# EAGLE design DIO (EAGLE 7.1.0)
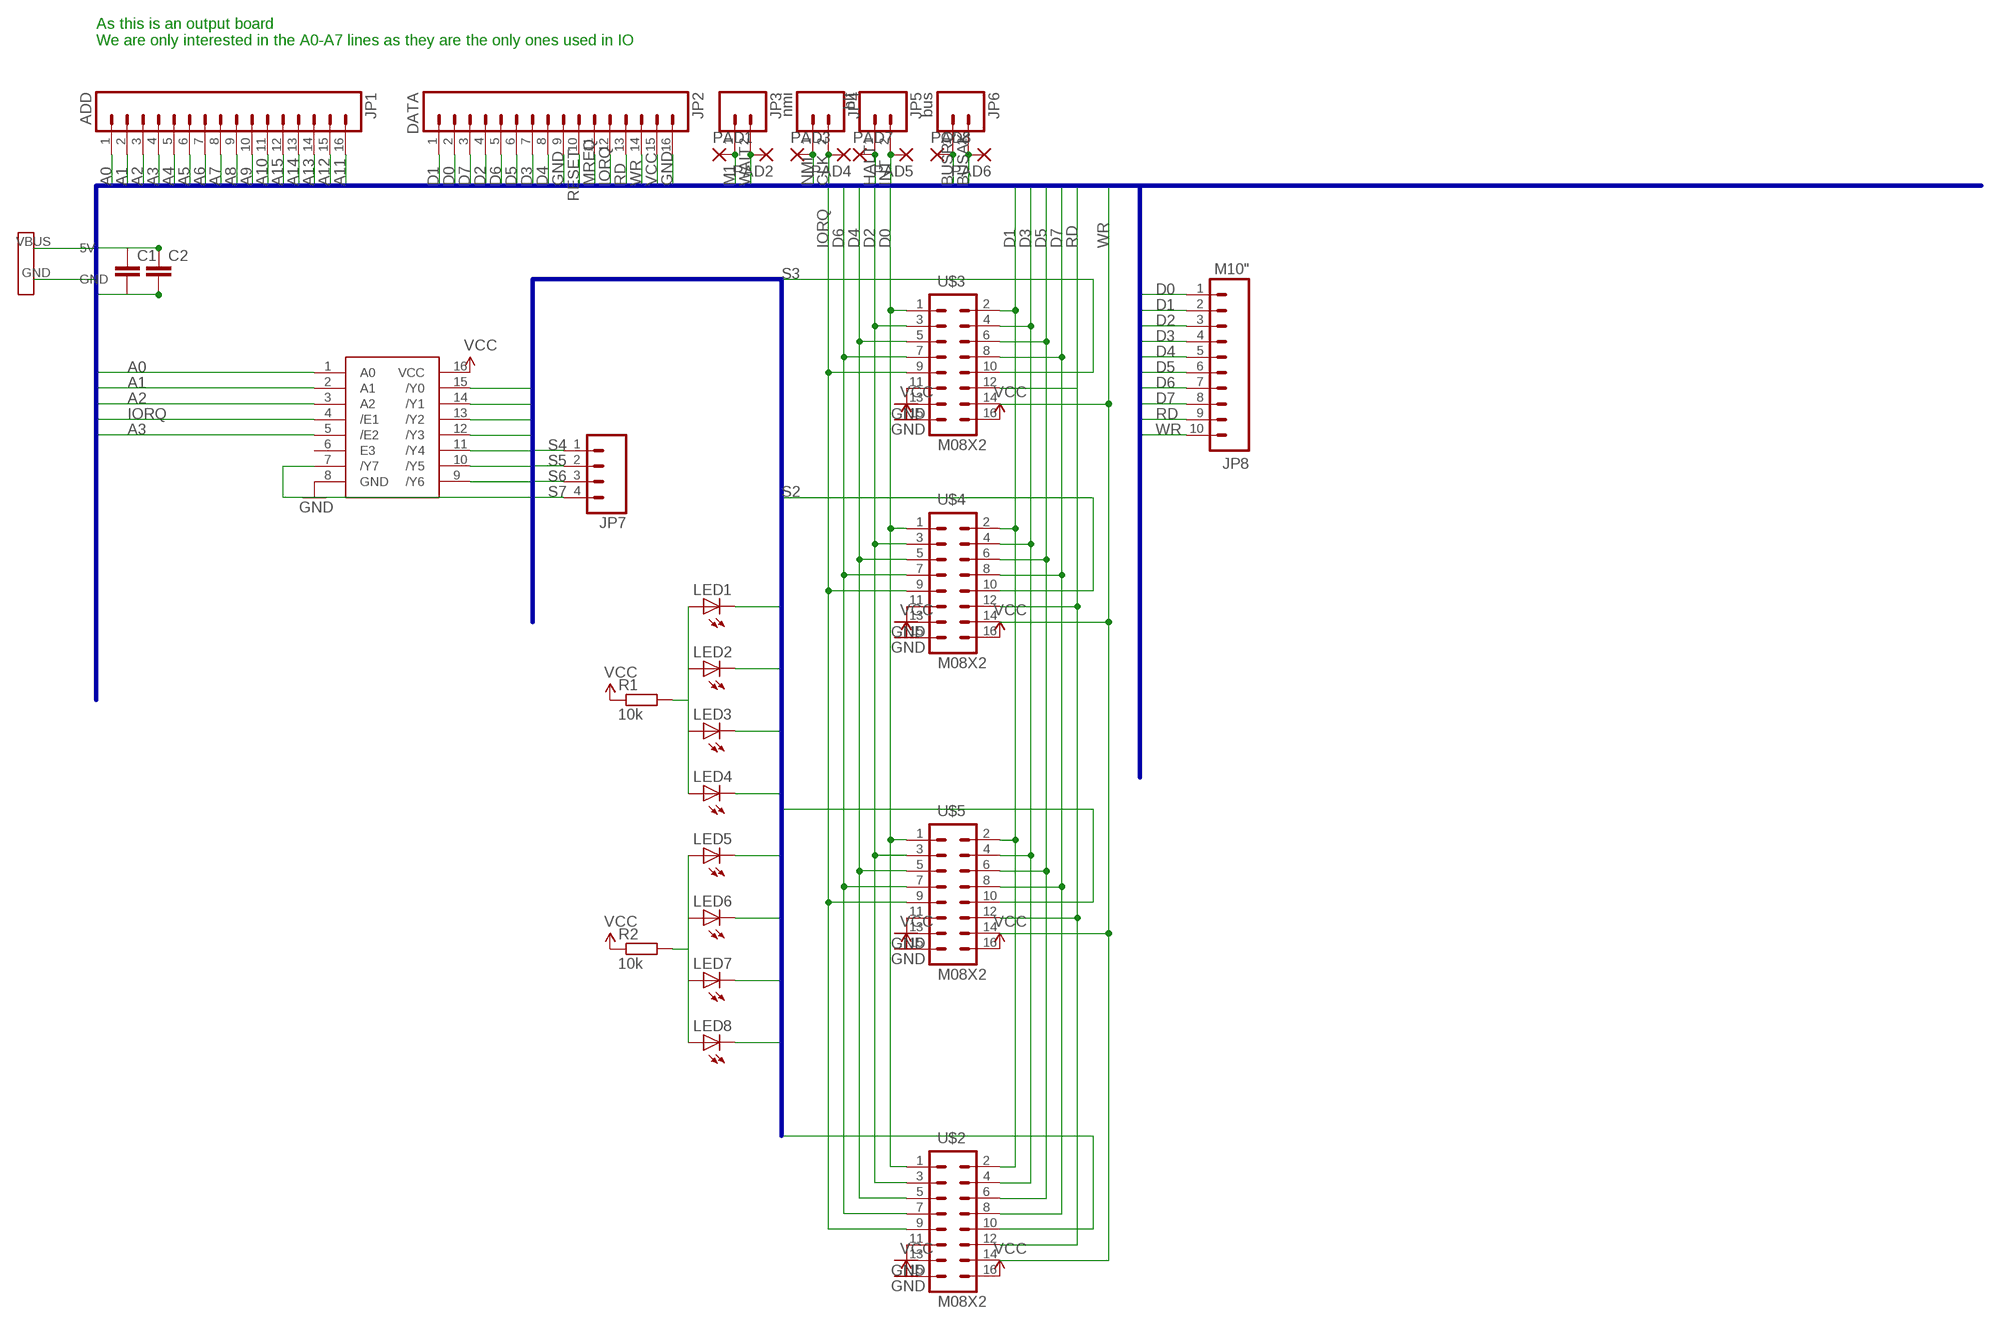
[diagram p0: schematic, sheet 1]

## Parts
C1  C-EUC0805  [C0805]
C2  C-EUC0805  [C0805]
JP1  ADD  M16PTH  [1X16]
JP2  DATA  M16PTH  [1X16]
JP3  M02PTH  [1X02]
JP4  nmi  M02PTH  [1X02]
JP5  hlt  M02PTH  [1X02]
JP6  bus  M02PTH  [1X02]
JP7  M04PTH  [1X04]
JP8  M10"  [1X10]
LED1  LEDCHIP-LED0805  [CHIP-LED0805]
LED2  LEDCHIP-LED0805  [CHIP-LED0805]
LED3  LEDCHIP-LED0805  [CHIP-LED0805]
LED4  LEDCHIP-LED0805  [CHIP-LED0805]
LED5  LEDCHIP-LED0805  [CHIP-LED0805]
LED6  LEDCHIP-LED0805  [CHIP-LED0805]
LED7  LEDCHIP-LED0805  [CHIP-LED0805]
LED8  LEDCHIP-LED0805  [CHIP-LED0805]
PAD1  SMD2  [SMD1,27-2,54]
PAD2  SMD2  [SMD1,27-2,54]
PAD3  SMD2  [SMD1,27-2,54]
PAD4  SMD2  [SMD1,27-2,54]
PAD5  SMD2  [SMD1,27-2,54]
PAD6  SMD2  [SMD1,27-2,54]
PAD7  SMD2  [SMD1,27-2,54]
PAD8  SMD2  [SMD1,27-2,54]
R1  10k  R-EU_M0805  [M0805]
R2  10k  R-EU_M0805  [M0805]
U$1  74LVC138AD  [SO016]
U$2  M08X2  [2X8]
U$3  M08X2  [2X8]
U$4  M08X2  [2X8]
U$5  M08X2  [2X8]
U$6  USB-MICRO-PWR  [USB-MICROB-PWR]

## Nets
A0: JP1.1 U$1.1(A0)
A1: JP1.2 U$1.2(A1)
A2: JP1.3 U$1.3(A2)
A3: JP1.4 U$1.5(/E2)
A4: JP1.5
A5: JP1.6
A6: JP1.7
A7: JP1.8
A8: JP1.9
A9: JP1.10
A10: JP1.11
A11: JP1.16
A12: JP1.15
A13: JP1.14
A14: JP1.13
A15: JP1.12
BUSAK: JP6.2 PAD6.1(P)
BUSRQ: JP6.1 PAD8.1(P)
CLK: JP4.2 PAD4.1(P)
D0: JP2.2 JP8.1 U$2.1 U$3.1 U$4.1 U$5.1
D1: JP2.1 JP8.2 U$2.2 U$3.2 U$4.2 U$5.2
D2: JP2.4 JP8.3 U$2.3 U$3.3 U$4.3 U$5.3
D3: JP2.7 JP8.4 U$2.4 U$3.4 U$4.4 U$5.4
D4: JP2.8 JP8.5 U$2.5 U$3.5 U$4.5 U$5.5
D5: JP2.6 JP8.6 U$2.6 U$3.6 U$4.6 U$5.6
D6: JP2.5 JP8.7 U$2.7 U$3.7 U$4.7 U$5.7
D7: JP2.3 JP8.8 U$2.8 U$3.8 U$4.8 U$5.8
GND: C1.2 C2.2 JP2.9 JP2.16 U$1.8(GND) U$2.11 U$2.13 U$3.11 U$3.13 U$4.11 U$4.13 U$5.11 U$5.13 U$6.GND
HALT: JP5.1 PAD7.1(P)
INT: JP5.2 PAD5.1(P)
IORQ: JP2.12 U$1.4(/E1) U$2.9 U$3.9 U$4.9 U$5.9
M1: JP3.1 PAD1.1(P)
MREQ: JP2.11
N$1: LED1.A LED2.A LED3.A LED4.A R1.2
N$2: LED5.A LED6.A LED7.A LED8.A R2.2
NMI: JP4.1 PAD3.1(P)
RD: JP2.13 JP8.9 U$2.12 U$3.12 U$4.12 U$5.12
RESET: JP2.10
S0: LED1.C U$1.15(/Y0) U$2.10
S1: LED2.C U$1.14(/Y1) U$5.10
S2: LED3.C U$1.13(/Y2) U$4.10
S3: LED4.C U$1.12(/Y3) U$3.10
S4: JP7.1 LED5.C U$1.11(/Y4)
S5: JP7.2 LED6.C U$1.10(/Y5)
S6: JP7.3 LED7.C U$1.9(/Y6)
S7: JP7.4 LED8.C U$1.7(/Y7)
VCC: C1.1 C2.1 JP2.15 R1.1 R2.1 U$1.16(VCC) U$2.15 U$2.16 U$3.15 U$3.16 U$4.15 U$4.16 U$5.15 U$5.16 U$6.VBUS(5V)
WAIT: JP3.2 PAD2.1(P)
WR: JP2.14 JP8.10 U$2.14 U$3.14 U$4.14 U$5.14
Unconnected: U$1.6(E3)

## Buses
A0,A1,A2,A3,A4,A5,A6,A7,A8,A9,A10,A11,A12,A13,A14,A15,D0,D1,D2,D3,D4,D5,D6,D7,GND,VCC,WR,RD,IORQ,MREQ,RESET,M1,CLK,WAIT,NMI,HALT,INT,BUSRQ,BUSAK
S0,S1,S2,S3,S4,S5,S6,S7

## Notes on the sheet
- As this is an output board
  We are only interested in the A0-A7 lines as they are the only ones used in IO

## Library data of the parts
C1 C2 = rcl:C-EU: CAPACITOR, European symbol
JP1 JP2 = SparkFun-Connectors:M16: 1x16 .1" header
JP3-JP6 = SparkFun:M02: Header 2 Standard 2-pin 0.1" header. Use with straight break away headers (SKU : PRT-00116), right angle break away headers (PRT-00553), swiss pins (PRT-00743), machine pins (PRT-00117), and female headers (PRT-00115). Molex polarized connector foot print use with SKU : PRT-08233 with associated crimp pins and housings.
JP7 = SparkFun-Connectors:M04: Header 4 Standard 4-pin 0.1" header. Use with straight break away headers (SKU : PRT-00116), right angle break away headers (PRT-00553), swiss pins (PRT-00743), machine pins (PRT-00117), and female headers (PRT-00115). Molex polarized connector foot print use with SKU : PRT-08231 with associated crimp pins and housings. 1MM SMD Version SKU: PRT-10208
JP8 = SparkFun:M10: Header 10 Standard 10-pin 0.1" header. Use with straight break away headers (SKU : PRT-00116), right angle break away headers (PRT-00553), swiss pins (PRT-00743), machine pins (PRT-00117), and female headers (PRT-00115).
LED1-LED8 = adafruit:LED: LED OSRAM: - CHIPLED LG R971, LG N971, LY N971, LG Q971, LY Q971, LO R971, LY R971 LH N974, LH R974 LS Q976, LO Q976, LY Q976 LO Q996 - Hyper CHIPLED LW Q18S LB Q993, LB Q99A, LB R99A - SideLED LS A670, LO A670, LY A670, LG A670, LP A670 LB A673, LV A673, LT A673, LW A673 LH A674 LY A675 LS A676, LA A676, LO A676, LY A676, LW A676 LS A679, LY A679, LG A679 - Hyper Micro SIDELED® LS Y876, LA Y876, LO Y876, LY Y876 LT Y87S - SmartLED LW L88C, LW L88S LB L89C, LB L89S, LG L890 LS L89K, LO L89K, LY L89K LS L896, LA L896, LO L896, LY L896 - TOPLED LS T670, LO T670, LY T670, LG T670, LP T670 LSG T670, LSP T670, LSY T670, LOP T670, LYG T670 LG T671, LOG T671, LSG T671 LB T673, LV T673, LT T673, LW T673 LH T674 LS T676, LA T676, LO T676, LY T676, LB T676, LH T676, LSB T676, LW T676 LB T67C, LV T67C, LT T67C, LS T67K, LO T67K, LY T67K, LW E67C LS E67B, LA E67B, LO E67B, LY E67B, LB E67C, LV E67C, LT E67C LW T67C LS T679, LY T679, LG T679 LS T770, LO T770, LY T770, LG T770, LP T770 LB T773, LV T773, LT T773, LW T773 LH T774 LS E675, LA E675, LY E675, LS T675 LS T776, LA T776, LO T776, LY T776, LB T776 LHGB T686 LT T68C, LB T68C - Hyper Mini TOPLED® LB M676 - Mini TOPLED Santana® LG M470 LS M47K, LO M47K, LY M47K Source: http://www.osram.convergy.de/
PAD1-PAD8 = wirepad:SMD2: SMD PAD
R1 R2 = rcl:R-EU_: RESISTOR, European symbol
U$1 = SparkFun-DigitalIC:74LVC138AD: 3-to-8 decoder
U$2-U$5 = SparkFun-Connectors:M08X2: .1" headers, two rows of 8 each
U$6 = RalimTek:USB-MICRO-PWR

## Board
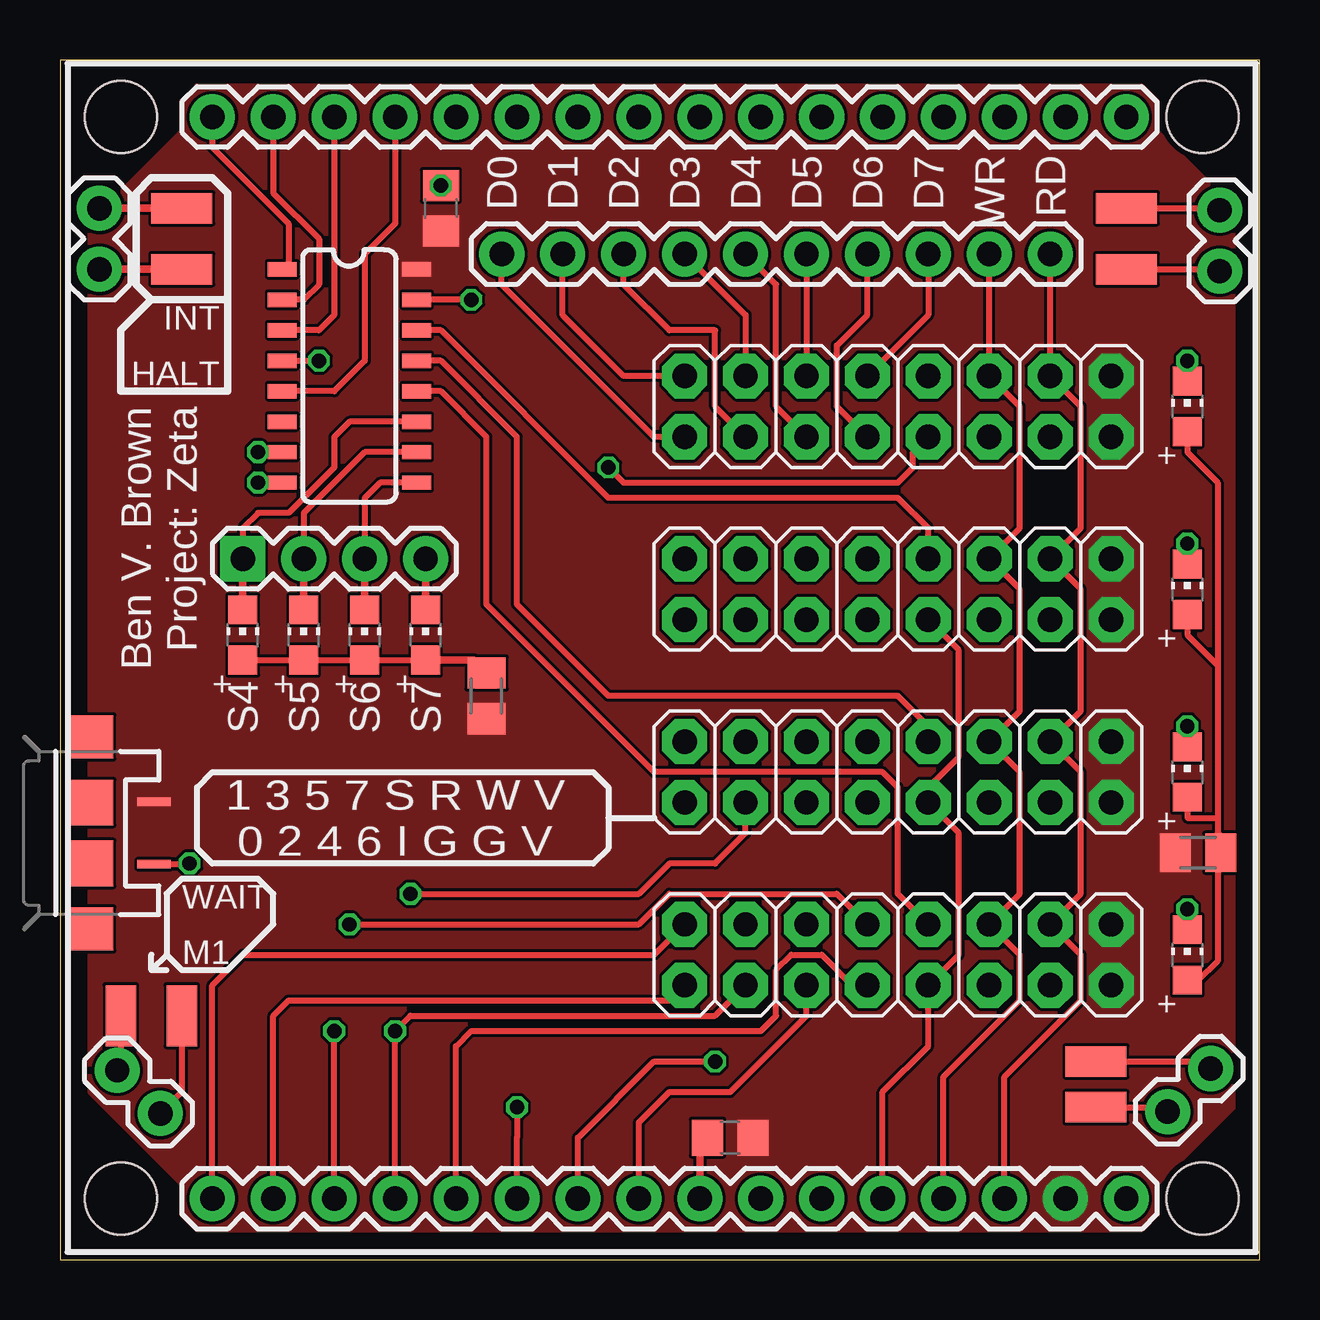
[diagram p1: board, top side]
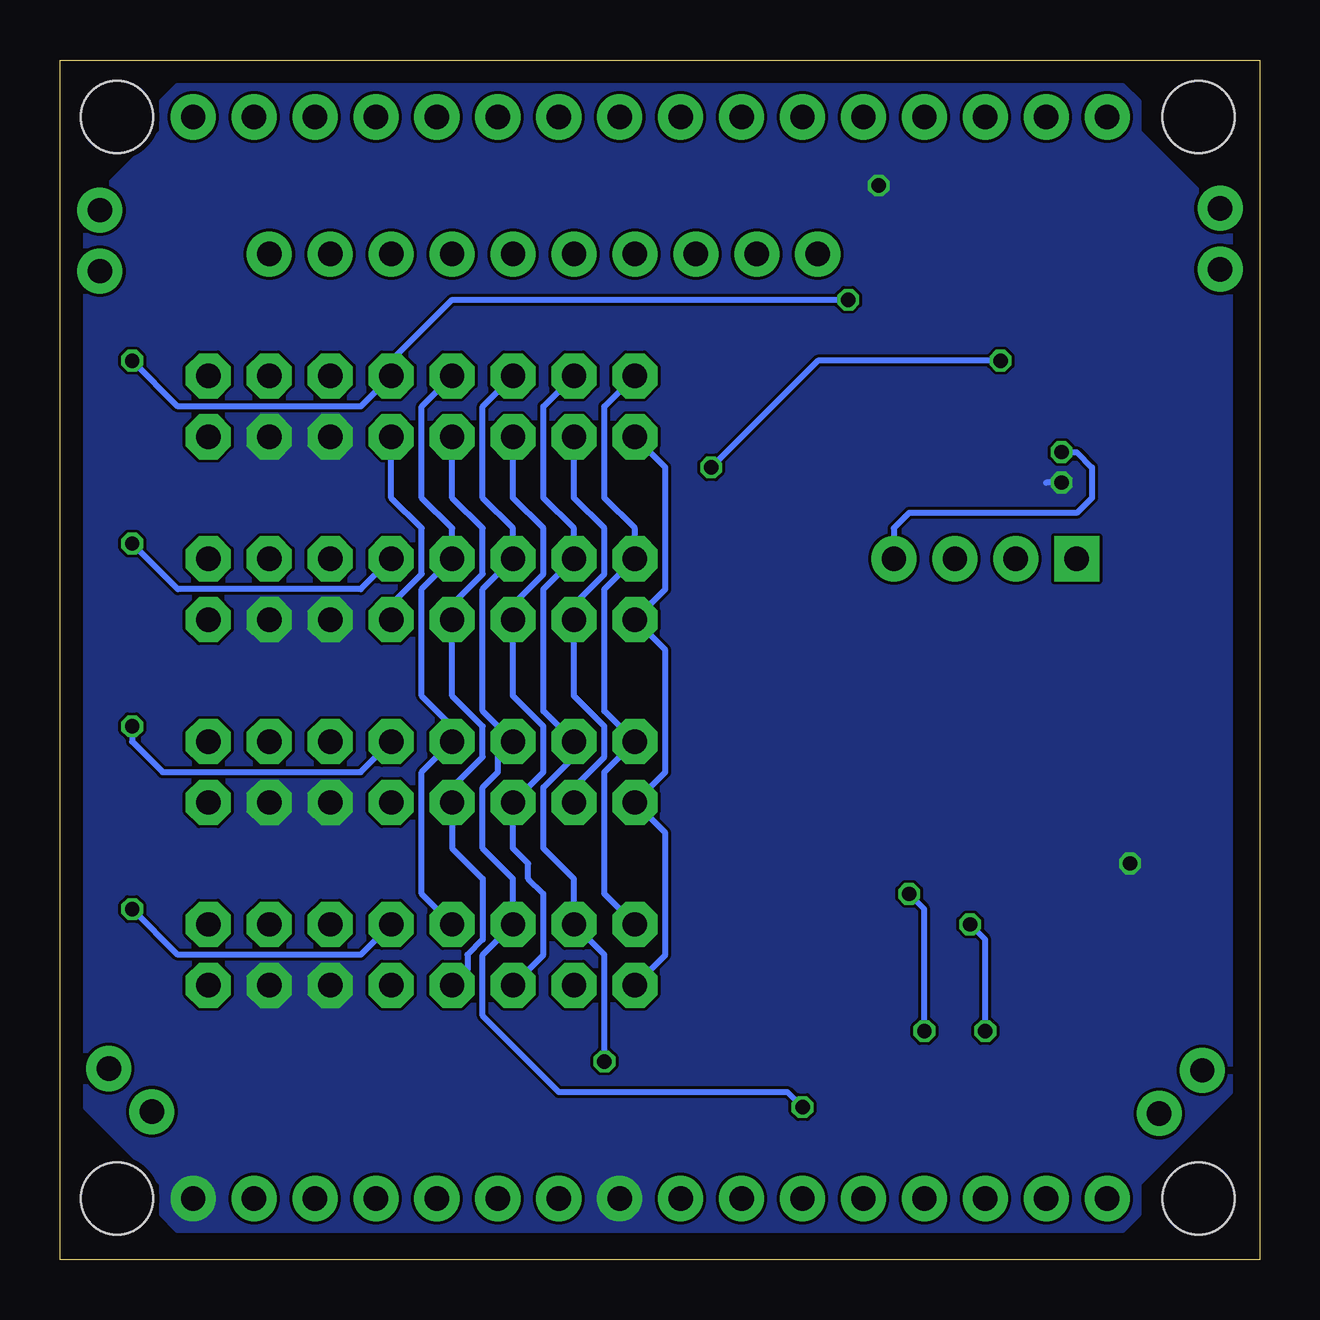
[diagram p2: board, bottom side, seen from below]

Size 50 x 50 mm. Coordinates in mm from the lower left corner, seen from the top.
Outline: 0,0 50,0 50,50 0,50 0,0
Copper layers (1*16): Top 0.035mm / dielectric 1.5mm / Bottom 0.035mm
Design rules "dirt_cheap_dirty_boards.v1": minimum track width 5mil, minimum drill 12mil, track to track 5mil, track to pad 5mil, pad to pad 5mil, via to via 5mil, smd to smd 0mil, copper to edge 10mil, drill to drill 10mil, minimum pad ring 10mil, minimum via ring 6mil, stop-mask expansion 2mil, vias tented up to drill 25mil, thermal gap 10mil
Holes 3 mm at 2.54,47.62 47.62,47.62 47.62,2.54 2.54,2.54

### Footprints (pad centres in the part's own frame; a part is rotated, then mirrored left to right if it is on the bottom)
C0805 = smd 1.3 x 1.5: 1 -0.95,0; 2 0.95,0
1X16 = drill 1.016 pad 1.88: 1 0,0; 2 2.54,0; 3 5.08,0; 4 7.62,0; 5 10.16,0; 6 12.7,0; 7 15.24,0; 8 17.78,0; 9 20.32,0; 10 22.86,0; 11 25.4,0; 12 27.94,0; 13 30.48,0; 14 33.02,0; 15 35.56,0; 16 38.1,0
1X02 = drill 1.016 pad 1.88: 1 0,0; 2 2.54,0
1X04 = drill 1.016 pad 1.88 square: 1 0,0 | drill 1.016 pad 1.88: 2 2.54,0; 3 5.08,0; 4 7.62,0
1X10 = drill 1.016 pad 1.88: 1 0,0; 2 2.54,0; 3 5.08,0; 4 7.62,0; 5 10.16,0; 6 12.7,0; 7 15.24,0; 8 17.78,0; 9 20.32,0; 10 22.86,0
CHIP-LED0805 = smd 1.2 x 1.2: A 0,-1.05; C 0,1.05
SMD1,27-2,54 = smd 1.27 x 2.54: 1 0,0
M0805 = smd 1.3 x 1.6: 1 -0.95,0; 2 0.95,0
SO016 = smd 0.6 x 1.2: 1 -4.445,-2.8; 2 -3.175,-2.8; 3 -1.905,-2.8; 4 -0.635,-2.8; 5 0.635,-2.8; 6 1.905,-2.8; 7 3.175,-2.8; 8 4.445,-2.8; 9 4.445,2.8; 10 3.175,2.8; 11 1.905,2.8; 12 0.635,2.8; 13 -0.635,2.8; 14 -1.905,2.8; 15 -3.175,2.8; 16 -4.445,2.8
2X8 = drill 1.016 pad 1.88 octagon: 1 0,0; 2 0,2.54; 3 2.54,0; 4 2.54,2.54; 5 5.08,0; 6 5.08,2.54; 7 7.62,0; 8 7.62,2.54; 9 10.16,0; 10 10.16,2.54; 11 12.7,0; 12 12.7,2.54; 13 15.24,0; 14 15.24,2.54; 15 17.78,0; 16 17.78,2.54
USB-MICROB-PWR = smd 0.35 x 1.4: GND 1.3,2.65; VBUS -1.3,2.65 | smd 1.8 x 1.9: MT1 -4,0; MT2 4,0 | smd 1.9 x 1.9: P$1 -1.27,0; P$2 1.27,0

### Placement (x,y rotation side)
C1  27.94,5.08 180 top
C2  15.88,43.81 90 top
JP1  6.35,47.62 0 top
JP2  6.35,2.54 0 top
JP3  4.18,6.09 135 top
JP4  46.17,6.16 45 top
JP5  1.64,41.27 90 top
JP6  48.34,41.2 90 top
JP7  7.62,29.21 0 top
JP8  18.41,41.91 0 top
LED1  46.99,35.56 0 top
LED2  46.99,27.94 0 top
LED3  46.99,20.32 0 top
LED4  46.99,12.7 0 top
LED5  7.62,26.04 0 top
LED6  10.16,26.04 0 top
LED7  12.7,26.04 0 top
LED8  15.24,26.04 0 top
PAD1  5.08,10.16 0 top
PAD2  2.54,10.16 0 top
PAD3  43.18,6.35 90 top
PAD4  43.18,8.26 90 top
PAD5  5.08,43.81 90 top
PAD6  44.45,43.81 90 top
PAD7  5.08,41.27 90 top
PAD8  44.45,41.27 90 top
R1  47.44,16.96 0 top
R2  17.78,23.5 90 top
U$1  12.06,36.83 270 top
U$2  26.04,34.29 0 top
U$3  26.04,11.43 0 top
U$4  26.04,19.05 0 top
U$5  26.04,26.67 0 top
U$6  1.27,17.78 270 top

### Tracks (layer width: path | path; a pad name or v marks a point on that pad's centre or on a via)
A0
  Top 0.254: JP1.1 6.35,46.35 9.53,43.18 9.53,41.53 U$1.1
A1
  Top 0.254: JP1.2 8.89,44.45 10.79,42.55 10.79,40.64 10.16,40.01 U$1.2
A2
  Top 0.254: JP1.3 11.43,39.37 10.79,38.73 U$1.3
A3
  Top 0.254: JP1.4 13.97,43.18 12.7,41.91 12.7,37.47 11.43,36.2 U$1.5
BUSAK
  Top 0.254: PAD6.1 48.26,43.81 JP6.2
BUSRQ
  Top 0.254: PAD8.1 48.26,41.27 JP6.1
CLK
  Top 0.254: PAD4.1 47.67,8.26 JP4.2
D0
  Top 0.254: JP2.2 8.89,10.16 9.53,10.79 25.4,10.79 U$3.1 | U$2.1 24.77,34.29 18.41,40.64 JP8.1
  Bottom 0.254: U$3.1 24.77,12.7 24.77,17.78 U$4.1 24.77,20.32 24.77,25.4 U$5.1 24.77,27.94 24.77,33.02 U$2.1
D1
  Top 0.254: JP2.1 6.35,11.43 7.62,12.7 24.77,12.7 U$3.2 | U$2.2 23.5,36.83 20.95,39.37 JP8.2
  Bottom 0.254: U$3.2 27.3,15.24 27.3,20.32 U$4.2 27.3,22.86 27.3,27.94 U$5.2 26.04,30.48 27.3,31.75 27.3,35.56 U$2.2
D2  (via drill 0.6)
  Top 0.254: JP2.4 v13.97,9.53 14.61,10.16 27.3,10.16 U$3.3 | v14.61,15.24 24.13,15.24 25.4,16.51 27.3,16.51 28.57,17.78 U$4.3 | U$2.3 27.3,35.56 27.3,38.73 25.4,38.73 23.5,40.64 JP8.3
  Bottom 0.254: v13.97,9.53 13.97,14.61 v14.61,15.24 | U$4.3 28.57,19.68 27.3,20.95 27.3,22.23 28.57,23.5 U$5.3 28.57,27.3 27.3,28.57 27.3,30.48 28.57,31.75 U$2.3
D3  (via drill 0.6)
  Top 0.254: JP2.7 21.59,5.08 24.77,8.26 v27.3,8.26 | JP8.4 28.57,39.37 U$2.4
  Bottom 0.254: v27.3,8.26 27.3,12.7 U$3.4 28.57,15.88 29.84,17.14 29.84,19.68 28.57,20.95 U$4.4 29.84,22.86 29.84,27.94 U$5.4 28.57,30.48 29.84,31.75 29.84,35.56 U$2.4
D4
  Top 0.254: JP2.8 24.13,5.71 25.4,6.99 27.94,6.99 31.11,10.16 U$3.5 | U$2.5 29.84,35.56 29.84,40.64 JP8.5
  Bottom 0.254: U$3.5 29.84,12.7 29.84,15.24 30.48,15.88 30.48,16.51 31.11,17.14 U$4.5 29.84,20.32 29.84,22.23 31.11,23.5 U$5.5 31.11,27.3 29.84,28.57 29.84,30.48 31.11,31.75 U$2.5
D5  (via drill 0.6)
  Top 0.254: JP2.6 19.05,5.08 v19.05,6.35 | JP8.6 U$2.6
  Bottom 0.254: U$2.6 32.38,35.56 32.38,31.75 31.11,30.48 U$5.6 32.38,27.94 32.38,22.86 U$4.6 31.75,20.95 31.75,20.32 32.38,19.68 32.38,17.14 31.11,15.88 U$3.6 32.38,12.7 32.38,10.16 29.21,6.99 19.68,6.99 v19.05,6.35
D6
  Top 0.254: JP2.5 16.51,8.89 17.14,9.53 29.21,9.53 29.84,10.16 29.84,12.06 30.48,12.7 31.75,12.7 33.02,11.43 U$3.7 | U$2.7 32.38,35.56 32.38,38.1 33.66,39.37 JP8.7
  Bottom 0.254: U$3.7 33.02,12.06 33.02,12.7 32.38,13.34 32.38,15.88 33.66,17.14 U$4.7 33.66,19.68 32.38,20.95 32.38,22.23 33.66,23.5 U$5.7 33.66,27.3 32.38,28.57 32.38,30.48 33.66,31.75 U$2.7
D7  (via drill 0.6)
  Top 0.254: JP2.3 v11.43,9.53 | v12.06,13.97 24.13,13.97 25.4,15.24 32.38,15.24 U$3.8 | JP8.8 36.2,39.37 U$2.8
  Bottom 0.254: v11.43,9.53 11.43,13.34 v12.06,13.97 | U$3.8 34.92,15.24 34.92,20.32 U$4.8 33.66,22.23 34.92,23.5 34.92,27.94 U$5.8 33.66,30.48 34.92,31.75 34.92,35.56 U$2.8
GND  (via drill 0.6)
  Top 0.254: U$1.8 v8.26,32.38 | U$6.GND 5.4,16.48 v5.4,16.51
  Top 0.305: 5.05,16.48 v5.4,16.51 | C1.2 26.67,4.76 JP2.9 | C2.2
  Bottom 0.254: v8.26,32.38 8.89,32.38
  other vias: 15.88,44.77
  pour Bottom (no thermals): 1.27,6.99 5.08,3.17 5.08,1.91 5.71,1.27 45.09,1.27 45.72,1.91 45.72,3.17 48.9,6.35 48.9,43.81 45.72,46.99 45.72,48.26 45.09,48.9 5.71,48.9 5.08,48.26 5.08,46.99 1.27,43.18
HALT
  Top 0.305: PAD7.1 | PAD7.1 JP5.1
INT
  Top 0.305: PAD5.1 | PAD5.1 JP5.2
IORQ  (via drill 0.6)
  Top 0.254: JP2.12 34.29,6.99 36.2,8.89 U$3.9 37.47,12.7 37.47,17.78 U$4.9 36.2,19.68 37.47,20.95 37.47,25.4 U$5.9 | U$1.4 v10.79,37.47 | v22.86,33.02 23.5,32.38 34.92,32.38 35.56,33.02 35.56,33.66 U$2.9
  Bottom 0.254: U$5.9 36.2,27.3 34.92,28.57 34.92,30.48 36.2,31.75 U$2.9 | v10.79,37.47 18.41,37.47 v22.86,33.02
M1
  Top 0.254: PAD1.1 5.08,6.99 JP3.1
N$1
  Top 0.254: LED1.A 46.99,33.66 48.26,32.38 48.26,24.77 | 48.26,24.77 48.26,18.41 | 48.26,18.41 48.26,17.78 | 48.26,17.78 48.26,12.44 47.47,11.65 LED4.A 46.99,11.17 | LED2.A 46.99,26.04 48.26,24.77 | LED3.A 46.99,18.41 48.26,18.41 | R1.2 48.39,17.65 48.26,17.78
N$2
  Top 0.254: LED5.A LED6.A LED7.A LED8.A
  Top 0.305: R2.2 17.24,24.98 LED8.A
NMI
  Top 0.254: PAD3.1 45.98,6.35 JP4.1
RD
  Top 0.254: JP2.13 36.83,7.62 40.01,10.79 40.01,12.7 U$3.12 40.01,15.24 40.01,20.32 U$4.12 40.01,22.86 40.01,27.94 U$5.12 40.01,30.48 40.01,35.56 U$2.12 JP8.9
S0  (via drill 0.6)
  Top 0.254: v17.14,40.01 U$1.15 | v46.99,37.47 LED1.C
  Bottom 0.254: v17.14,40.01 33.66,40.01 36.2,37.47 U$2.10 37.47,35.56 45.09,35.56 v46.99,37.47
S1  (via drill 0.6)
  Top 0.254: U$5.10 36.2,30.48 34.92,31.75 22.86,31.75 15.88,38.73 U$1.14 | v46.99,29.84 LED2.C
  Bottom 0.254: U$5.10 37.47,27.94 45.09,27.94 v46.99,29.84
S2  (via drill 0.6)
  Top 0.254: U$1.13 15.88,37.47 19.05,34.29 19.05,27.3 22.86,23.5 34.92,23.5 36.2,22.23 U$4.10 | LED3.C v46.99,22.23
  Bottom 0.254: v46.99,22.23 46.99,21.59 45.72,20.32 37.47,20.32 U$4.10
S3  (via drill 0.6)
  Top 0.254: U$3.10 34.92,15.24 34.92,19.68 34.29,20.32 24.77,20.32 17.78,27.3 17.78,34.29 15.88,36.2 U$1.12 | v46.99,14.61 LED4.C
  Bottom 0.254: U$3.10 37.47,12.7 45.09,12.7 v46.99,14.61
S4
  Top 0.254: U$1.11 12.06,34.92 11.43,34.29 11.43,33.02 9.53,31.11 8.26,31.11 7.62,30.48 JP7.1
  Top 0.305: LED5.C JP7.1
S5
  Top 0.254: U$1.10 12.7,33.66 10.16,31.11 JP7.2
  Top 0.305: LED6.C JP7.2
S6
  Top 0.254: U$1.9 13.34,32.38 12.7,31.75 JP7.3
  Top 0.305: LED7.C JP7.3
S7  (via drill 0.6)
  Top 0.254: U$1.7 v8.26,33.66
  Top 0.305: LED8.C JP7.4
  Bottom 0.254: v8.26,33.66 7.62,33.66 6.99,33.02 6.99,31.75 7.62,31.11 14.61,31.11 15.24,30.48 JP7.4
VCC
  pour Top (no thermals): 1.27,6.99 5.08,3.17 5.08,1.91 5.71,1.27 45.09,1.27 45.72,1.91 45.72,3.17 48.9,6.35 48.9,43.81 45.72,46.99 45.72,48.26 45.09,48.9 5.71,48.9 5.08,48.26 5.08,46.99 1.27,43.18
WAIT
  Top 0.254: PAD2.1 2.54,8.04 JP3.2
WR
  Top 0.254: JP2.14 39.37,7.62 42.55,10.79 42.55,12.7 U$3.14 42.55,15.24 42.55,20.32 U$4.14 42.55,22.86 42.55,27.94 U$5.14 42.55,30.48 42.55,35.56 U$2.14 JP8.10

### Text on the board
tPlace: D0 / D1 / D2 / D3 / D4 / D5 / D6 / D7 / WR / RD | INT / HALT | Ben V. Brown | Project: Zeta | S4 / S5 / S6 / S7 | 1 3 5 7 S R W V / 0 2 4 6 I G G V | WAIT / M1